# EAGLE design mother4 (EAGLE 8.3.1)
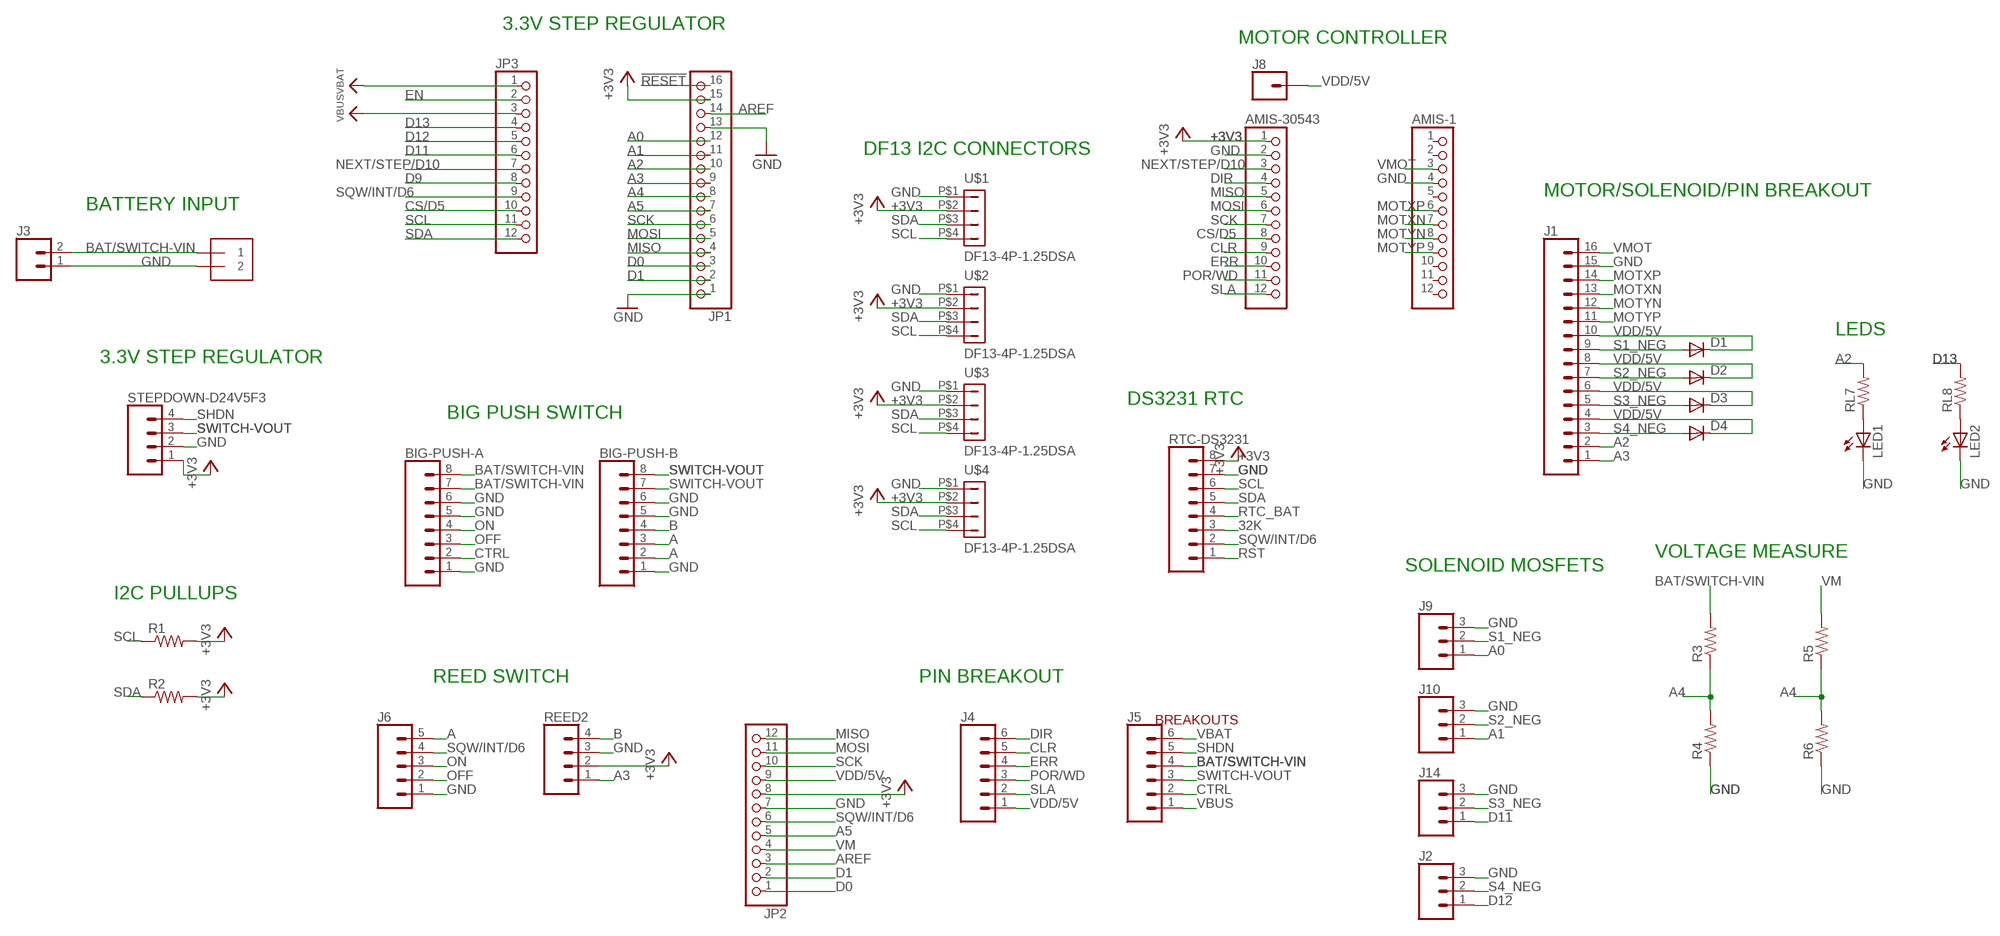
[diagram p0: schematic, sheet 1]

## Parts
AMIS-1  PINHD-1X12-CB  [1X12-CB]
AMIS-30543  PINHD-1X12-CB  [1X12-CB]
BAT  1X2-3.5MM  [1X2-3.5MM]
BIG-PUSH-A  CONN_08"  [1X08]
BIG-PUSH-B  CONN_08"  [1X08]
D1  1N4148DO35-7  [DO35-7]
D2  1N4148DO35-7  [DO35-7]
D3  1N4148DO35-7  [DO35-7]
D4  1N4148DO35-7  [DO35-7]
J1  CONN_16  [1X16]
J2  CONN_03  [1X03]
J3  CONN_02  [1X02]
J4  CONN_06SILK_FEMALE_PTH  [1X06]
J5  CONN_06SILK_FEMALE_PTH  [1X06]
J6  CONN_05  [1X05]
J8  CONN_01  [1X01]
J9  CONN_03  [1X03]
J10  CONN_03  [1X03]
J14  CONN_03  [1X03]
JP1  HEADER-1X16ROUND  [1X16_ROUND]
JP2  HEADER-1X12  [1X12_ROUND]
JP3  HEADER-1X12  [1X12_ROUND]
LED1  LED5MM  [LED5MM]
LED2  LED5MM  [LED5MM]
R1  R-US_0207/10  [0207/10]
R2  R-US_0207/10  [0207/10]
R3  R-US_0207/10  [0207/10]
R4  R-US_0207/10  [0207/10]
R5  R-US_0207/10  [0207/10]
R6  R-US_0207/10  [0207/10]
REED2  CONN_04  [1X04]
RL7  R-US_0207/10  [0207/10]
RL8  R-US_0207/10  [0207/10]
RTC-DS3231  CONN_08"  [1X08]
STEPDOWN-D24V5F3  CONN_04  [1X04]
U$1  DF13-4P-1.25DSA  [DF13-4P-1.25DSA]
U$2  DF13-4P-1.25DSA  [DF13-4P-1.25DSA]
U$3  DF13-4P-1.25DSA  [DF13-4P-1.25DSA]
U$4  DF13-4P-1.25DSA  [DF13-4P-1.25DSA]

## Nets
32K: RTC-DS3231.3
!RESET: JP1.16
+3V3: AMIS-30543.1 JP1.15 JP2.8 R1.2 R2.2 REED2.2 RTC-DS3231.8 STEPDOWN-D24V5F3.1 U$1.P$2 U$2.P$2 U$3.P$2 U$4.P$2
A: BIG-PUSH-B.2 BIG-PUSH-B.3 J6.5
A0: J9.1 JP1.12
A1: J10.1 JP1.11
A2: J1.2 JP1.10 RL7.2
A3: J1.1 JP1.9 REED2.1
A4: JP1.8 R3.1 R4.2 R5.1 R6.2
A5: JP1.7 JP2.5
AREF: JP1.14 JP2.3
B: BIG-PUSH-B.4 REED2.4
BAT/SWITCH-VIN: BAT.1 BIG-PUSH-A.7 BIG-PUSH-A.8 J3.2 J5.4 R3.2
CLR: AMIS-30543.9 J4.5
CS/D5: AMIS-30543.8 JP3.10
CTRL: BIG-PUSH-A.2 J5.2
D0: JP1.3 JP2.1
D1: JP1.2 JP2.2
D9: JP3.8
D11: J14.1 JP3.6
D12: J2.1 JP3.5
D13: JP3.4 RL8.2
DIR: AMIS-30543.4 J4.6
EN: JP3.2
ERR: AMIS-30543.10 J4.4
GND: AMIS-1.4 AMIS-30543.2 BAT.2 BIG-PUSH-A.1 BIG-PUSH-A.5 BIG-PUSH-A.6 BIG-PUSH-B.1 BIG-PUSH-B.5 BIG-PUSH-B.6 J1.15 J2.3 J3.1 J6.1 J9.3 J10.3 J14.3 JP1.1 JP1.13 JP2.7 LED1.K(C) LED2.K(C) R4.1 R6.1 REED2.3 RTC-DS3231.7 STEPDOWN-D24V5F3.2 U$1.P$1 U$2.P$1 U$3.P$1 U$4.P$1
MISO: AMIS-30543.5 JP1.4 JP2.12
MOSI: AMIS-30543.6 JP1.5 JP2.11
MOTXN: AMIS-1.7 J1.13
MOTXP: AMIS-1.6 J1.14
MOTYN: AMIS-1.8 J1.12
MOTYP: AMIS-1.9 J1.11
N$1: LED1.A RL7.1
N$2: LED2.A RL8.1
NEXT/STEP/D10: AMIS-30543.3 JP3.7
OFF: BIG-PUSH-A.3 J6.2
ON: BIG-PUSH-A.4 J6.3
POR/WD: AMIS-30543.11 J4.3
RST: RTC-DS3231.1
RTC_BAT: RTC-DS3231.4
S1_NEG: D1.A J1.9 J9.2
S2_NEG: D2.A J1.7 J10.2
S3_NEG: D3.A J1.5 J14.2
S4_NEG: D4.A J1.3 J2.2
SCK: AMIS-30543.7 JP1.6 JP2.10
SCL: JP3.11 R1.1 RTC-DS3231.6 U$1.P$4 U$2.P$4 U$3.P$4 U$4.P$4
SDA: JP3.12 R2.1 RTC-DS3231.5 U$1.P$3 U$2.P$3 U$3.P$3 U$4.P$3
SHDN: J5.5 STEPDOWN-D24V5F3.4
SLA: AMIS-30543.12 J4.2
SQW/INT/D6: J6.4 JP2.6 JP3.9 RTC-DS3231.2
SWITCH-VOUT: BIG-PUSH-B.7 BIG-PUSH-B.8 J5.3 STEPDOWN-D24V5F3.3
VBAT: J5.6 JP3.1
VBUS: J5.1 JP3.3
VDD/5V: D1.C D2.C D3.C D4.C J1.4 J1.6 J1.8 J1.10 J4.1 J8.1 JP2.9
VM: JP2.4 R5.2
VMOT: AMIS-1.3 J1.16
Unconnected: AMIS-1.1 AMIS-1.2 AMIS-1.5 AMIS-1.10 AMIS-1.11 AMIS-1.12

## Notes on the sheet
- 3.3V STEP REGULATOR
- MOTOR CONTROLLER
- DF13 I2C CONNECTORS
- MOTOR/SOLENOID/PIN BREAKOUT
- BATTERY INPUT
- LEDS
- 3.3V STEP REGULATOR
- DS3231 RTC
- BIG PUSH SWITCH
- VOLTAGE MEASURE
- SOLENOID MOSFETS
- I2C PULLUPS
- REED SWITCH | PIN BREAKOUT
- BREAKOUTS

## Library data of the parts
AMIS-1 AMIS-30543 = adafruit:PINHD-1X12: PIN HEADER
BAT = adafruit:1X2: 3.5mm Terminal block http://www.ladyada.net/library/pcb/eaglelibrary.html
BIG-PUSH-A BIG-PUSH-B RTC-DS3231 = SparkFun-Connectors:CONN_08: Multi connection point. Often used as Generic Header-pin footprint for 0.1 inch spaced/style header connections On any of the 0.1 inch spaced packages, you can populate with these: Break Away Headers - Straight <https://www.sparkfun.com/products/116> (PRT-00116) Break Away Male Headers - Right Angle <https://www.sparkfun.com/products/553> (PRT-00553) Female Headers <https://www.sparkfun.com/products/115> (PRT-00115) Break Away Headers - Machine Pin <https://www.sparkfun.com/products/117> (PRT-00117) Break Away Female Headers - Swiss Machine Pin <https://www.sparkfun.com/products/743> (PRT-00743) Arduino Stackable Header - 8 Pin <https://www.sparkfun.com/products/9279> (PRT-09279) For SCREWTERMINALS and SPRING TERMINALS visit here: Screw Terimnals on SparkFun.com <https://www.sparkfun.com/search/results?term=Screw+Terminals> (5mm/3.5mm/2.54mm spacing) This device is also useful as a general connection point to wire up your design to another part of your project. Our various solder wires solder well into these plated through hole pads. Hook-Up Wire - Assortment (Stranded, 22 AWG) <https://www.sparkfun.com/products/11375> (PRT-11375) Hook-Up Wire - Assortment (Solid Core, 22 AWG) <https://www.sparkfun.com/products/11367> (PRT-11367) View the entire wire category on our website here <https://www.sparkfun.com/categories/141> Special notes: Molex polarized connector foot print use with SKU : PRT-08231 with associated crimp pins and housings. 1MM SMD Version SKU: PRT-10208 NOTES ON THE VARIANTS LOCK and LOCK_LONGPADS... This footprint was designed to help hold the alignment of a through-hole component (i.e. 6-pin header) while soldering it into place. You may notice that each hole has been shifted either up or down by 0.005 of an inch from it's more standard position (which is a perfectly straight line). This slight alteration caused the pins (the squares in the middle) to touch the edges of the holes. Because they are alternating, it causes a "brace" to hold the component in place. 0.005 has proven to be the perfect amount of "off-center" position when using our standard breakaway headers. Although looks a little odd when you look at the bare footprint, once you have a header in there, the alteration is very hard to notice. Also,if you push a header all the way into place, it is covered up entirely on the bottom side.; PROD_ID: CONN-08438
D1-D4 = diode:1N4148: DIODE high speed (Philips)
J1 = SparkFun-Connectors:CONN_16: Multi connection point. Often used as Generic Header-pin footprint for 0.1 inch spaced/style header connections On any of the 0.1 inch spaced packages, you can populate with these: Break Away Headers - Straight <https://www.sparkfun.com/products/116> (PRT-00116) Break Away Male Headers - Right Angle <https://www.sparkfun.com/products/553> (PRT-00553) Female Headers <https://www.sparkfun.com/products/115> (PRT-00115) Break Away Headers - Machine Pin <https://www.sparkfun.com/products/117> (PRT-00117) Break Away Female Headers - Swiss Machine Pin <https://www.sparkfun.com/products/743> (PRT-00743) For SCREWTERMINALS and SPRING TERMINALS visit here: Screw Terimnals on SparkFun.com <https://www.sparkfun.com/search/results?term=Screw+Terminals> (5mm/3.5mm/2.54mm spacing) This device is also useful as a general connection point to wire up your design to another part of your project. Our various solder wires solder well into these plated through hole pads. Hook-Up Wire - Assortment (Stranded, 22 AWG) <https://www.sparkfun.com/products/11375> (PRT-11375) Hook-Up Wire - Assortment (Solid Core, 22 AWG) <https://www.sparkfun.com/products/11367> (PRT-11367) View the entire wire category on our website here <https://www.sparkfun.com/categories/141> Special notes: Molex polarized connector foot print use with SKU : PRT-08231 with associated crimp pins and housings. 1MM SMD Version SKU: PRT-10208 NOTES ON THE VARIANTS LOCK and LOCK_LONGPADS... This footprint was designed to help hold the alignment of a through-hole component (i.e. 6-pin header) while soldering it into place. You may notice that each hole has been shifted either up or down by 0.005 of an inch from it's more standard position (which is a perfectly straight line). This slight alteration caused the pins (the squares in the middle) to touch the edges of the holes. Because they are alternating, it causes a "brace" to hold the component in place. 0.005 has proven to be the perfect amount of "off-center" position when using our standard breakaway headers. Although looks a little odd when you look at the bare footprint, once you have a header in there, the alteration is very hard to notice. Also,if you push a header all the way into place, it is covered up entirely on the bottom side.
J2 J9 J10 J14 = SparkFun-Connectors:CONN_03: Multi connection point. Often used as Generic Header-pin footprint for 0.1 inch spaced/style header connections On any of the 0.1 inch spaced packages, you can populate with these: Break Away Headers - Straight <https://www.sparkfun.com/products/116> (PRT-00116) Break Away Male Headers - Right Angle <https://www.sparkfun.com/products/553> (PRT-00553) Female Headers <https://www.sparkfun.com/products/115> (PRT-00115) Break Away Headers - Machine Pin <https://www.sparkfun.com/products/117> (PRT-00117) Break Away Female Headers - Swiss Machine Pin <https://www.sparkfun.com/products/743> (PRT-00743) Stackable Header - 3 Pin (Female, 0.1") <https://www.sparkfun.com/products/13875> (PRT-13875) For SCREWTERMINALS and SPRING TERMINALS visit here: Screw Terimnals on SparkFun.com <https://www.sparkfun.com/search/results?term=Screw+Terminals> (5mm/3.5mm/2.54mm spacing) This device is also useful as a general connection point to wire up your design to another part of your project. Our various solder wires solder well into these plated through hole pads. Hook-Up Wire - Assortment (Stranded, 22 AWG) <https://www.sparkfun.com/products/11375> (PRT-11375) Hook-Up Wire - Assortment (Solid Core, 22 AWG) <https://www.sparkfun.com/products/11367> (PRT-11367) View the entire wire category on our website here <https://www.sparkfun.com/categories/141> Special notes: Molex polarized connector foot print use with SKU : PRT-08232 with associated crimp pins and housings.
J3 = SparkFun-Connectors:CONN_02: Multi connection point. Often used as Generic Header-pin footprint for 0.1 inch spaced/style header connections On any of the 0.1 inch spaced packages, you can populate with these: Break Away Headers - Straight <https://www.sparkfun.com/products/116> (PRT-00116) Break Away Male Headers - Right Angle <https://www.sparkfun.com/products/553> (PRT-00553) Female Headers <https://www.sparkfun.com/products/115> (PRT-00115) Break Away Headers - Machine Pin <https://www.sparkfun.com/products/117> (PRT-00117) Break Away Female Headers - Swiss Machine Pin <https://www.sparkfun.com/products/743> (PRT-00743) For SCREWTERMINALS and SPRING TERMINALS visit here: Screw Terimnals on SparkFun.com <https://www.sparkfun.com/search/results?term=Screw+Terminals> (5mm/3.5mm/2.54mm spacing) This device is also useful as a general connection point to wire up your design to another part of your project. Our various solder wires solder well into these plated through hole pads. Hook-Up Wire - Assortment (Stranded, 22 AWG) <https://www.sparkfun.com/products/11375> (PRT-11375) Hook-Up Wire - Assortment (Solid Core, 22 AWG) <https://www.sparkfun.com/products/11367> (PRT-11367) View the entire wire category on our website here <https://www.sparkfun.com/categories/141> Special notes: Molex polarized connector foot print use with: PRT-08233 with associated crimp pins and housings. 2.54_SCREWTERM for use with PRT-10571. 3.5mm Screw Terminal footprints for PRT-08084 5mm Screw Terminal footprints for use with PRT-08432
J4 J5 = SparkFun-Connectors:CONN_06: Multi connection point. Often used as Generic Header-pin footprint for 0.1 inch spaced/style header connections On any of the 0.1 inch spaced packages, you can populate with these: Break Away Headers - Straight <https://www.sparkfun.com/products/116> (PRT-00116) Break Away Male Headers - Right Angle <https://www.sparkfun.com/products/553> (PRT-00553) Female Headers <https://www.sparkfun.com/products/115> (PRT-00115) Break Away Headers - Machine Pin <https://www.sparkfun.com/products/117> (PRT-00117) Break Away Female Headers - Swiss Machine Pin <https://www.sparkfun.com/products/743> (PRT-00743) Arduino Stackable Header - 6 Pin <https://www.sparkfun.com/products/9280> (PRT-09280) For SCREWTERMINALS and SPRING TERMINALS visit here: Screw Terimnals on SparkFun.com <https://www.sparkfun.com/search/results?term=Screw+Terminals> (5mm/3.5mm/2.54mm spacing) This device is also useful as a general connection point to wire up your design to another part of your project. Our various solder wires solder well into these plated through hole pads. Hook-Up Wire - Assortment (Stranded, 22 AWG) <https://www.sparkfun.com/products/11375> (PRT-11375) Hook-Up Wire - Assortment (Solid Core, 22 AWG) <https://www.sparkfun.com/products/11367> (PRT-11367) View the entire wire category on our website here <https://www.sparkfun.com/categories/141>; PROD_ID: CONN-08437
J6 = SparkFun-Connectors:CONN_05: Multi connection point. Often used as Generic Header-pin footprint for 0.1 inch spaced/style header connections On any of the 0.1 inch spaced packages, you can populate with these: Break Away Headers - Straight <https://www.sparkfun.com/products/116> (PRT-00116) Break Away Male Headers - Right Angle <https://www.sparkfun.com/products/553> (PRT-00553) Female Headers <https://www.sparkfun.com/products/115> (PRT-00115) Break Away Headers - Machine Pin <https://www.sparkfun.com/products/117> (PRT-00117) Break Away Female Headers - Swiss Machine Pin <https://www.sparkfun.com/products/743> (PRT-00743) For SCREWTERMINALS and SPRING TERMINALS visit here: Screw Terimnals on SparkFun.com <https://www.sparkfun.com/search/results?term=Screw+Terminals> (5mm/3.5mm/2.54mm spacing) This device is also useful as a general connection point to wire up your design to another part of your project. Our various solder wires solder well into these plated through hole pads. Hook-Up Wire - Assortment (Stranded, 22 AWG) <https://www.sparkfun.com/products/11375> (PRT-11375) Hook-Up Wire - Assortment (Solid Core, 22 AWG) <https://www.sparkfun.com/products/11367> (PRT-11367) View the entire wire category on our website here <https://www.sparkfun.com/categories/141> Special notes: Molex polarized connector foot print use with SKU : PRT-08231 with associated crimp pins and housings. 1MM SMD Version SKU: PRT-10208
J8 = SparkFun-Connectors:CONN_01: Single connection point. Often used as Generic Header-pin footprint for 0.1 inch spaced/style header connections On any of the 0.1 inch spaced packages, you can populate with these: Break Away Headers - Straight <https://www.sparkfun.com/products/116> (PRT-00116) Break Away Male Headers - Right Angle <https://www.sparkfun.com/products/553> (PRT-00553) Female Headers <https://www.sparkfun.com/products/115> (PRT-00115) Break Away Headers - Machine Pin <https://www.sparkfun.com/products/117> (PRT-00117) Break Away Female Headers - Swiss Machine Pin <https://www.sparkfun.com/products/743> (PRT-00743) This device is also useful as a general connection point to wire up your design to another part of your project. Our various solder wires solder well into these plated through hole pads. Hook-Up Wire - Assortment (Stranded, 22 AWG) <https://www.sparkfun.com/products/11375> (PRT-11375) Hook-Up Wire - Assortment (Solid Core, 22 AWG) <https://www.sparkfun.com/products/11367> (PRT-11367) View the entire wire category on our website here <https://www.sparkfun.com/categories/141> Special notes: SMTSO-256-ET is a "flush mount" nut for a 4-40 screw. We mostly use this on specialty testbeds; it is a nice way to connect hardware to your PCB at an adjustable hieght. Also note, the SNAP packages are for using a snappable style connector. We sell a baggie of snaps and they are also used on two LilyPad designs: Snap Assortment - 30 pack (male and female) <https://www.sparkfun.com/products/11347> (DEV-11347) LilyPad Arduino SimpleSnap <https://www.sparkfun.com/products/10941> (DEV-10941) LilyPad SimpleSnap Protoboard <https://www.sparkfun.com/products/10940> (DEV-10940)
JP1 = microbuilder:HEADER-1X16: PIN HEADER
JP2 JP3 = microbuilder:HEADER-1X12
LED1 LED2 = adafruit:LED: LED OSRAM: - CHIPLED LG R971, LG N971, LY N971, LG Q971, LY Q971, LO R971, LY R971 LH N974, LH R974 LS Q976, LO Q976, LY Q976 LO Q996 - Hyper CHIPLED LW Q18S LB Q993, LB Q99A, LB R99A - SideLED LS A670, LO A670, LY A670, LG A670, LP A670 LB A673, LV A673, LT A673, LW A673 LH A674 LY A675 LS A676, LA A676, LO A676, LY A676, LW A676 LS A679, LY A679, LG A679 - Hyper Micro SIDELED® LS Y876, LA Y876, LO Y876, LY Y876 LT Y87S - SmartLED LW L88C, LW L88S LB L89C, LB L89S, LG L890 LS L89K, LO L89K, LY L89K LS L896, LA L896, LO L896, LY L896 - TOPLED LS T670, LO T670, LY T670, LG T670, LP T670 LSG T670, LSP T670, LSY T670, LOP T670, LYG T670 LG T671, LOG T671, LSG T671 LB T673, LV T673, LT T673, LW T673 LH T674 LS T676, LA T676, LO T676, LY T676, LB T676, LH T676, LSB T676, LW T676 LB T67C, LV T67C, LT T67C, LS T67K, LO T67K, LY T67K, LW E67C LS E67B, LA E67B, LO E67B, LY E67B, LB E67C, LV E67C, LT E67C LW T67C LS T679, LY T679, LG T679 LS T770, LO T770, LY T770, LG T770, LP T770 LB T773, LV T773, LT T773, LW T773 LH T774 LS E675, LA E675, LY E675, LS T675 LS T776, LA T776, LO T776, LY T776, LB T776 LHGB T686 LT T68C, LB T68C - Hyper Mini TOPLED® LB M676 - Mini TOPLED Santana® LG M470 LS M47K, LO M47K, LY M47K Source: http://www.osram.convergy.de/
R1-R6 RL7 RL8 = adafruit:R-US_: RESISTOR, American symbol
REED2 STEPDOWN-D24V5F3 = SparkFun-Connectors:CONN_04: Multi connection point. Often used as Generic Header-pin footprint for 0.1 inch spaced/style header connections On any of the 0.1 inch spaced packages, you can populate with these: Break Away Headers - Straight <https://www.sparkfun.com/products/116> (PRT-00116) Break Away Male Headers - Right Angle <https://www.sparkfun.com/products/553> (PRT-00553) Female Headers <https://www.sparkfun.com/products/115> (PRT-00115) Break Away Headers - Machine Pin <https://www.sparkfun.com/products/117> (PRT-00117) Break Away Female Headers - Swiss Machine Pin <https://www.sparkfun.com/products/743> (PRT-00743) For SCREWTERMINALS and SPRING TERMINALS visit here: Screw Terimnals on SparkFun.com <https://www.sparkfun.com/search/results?term=Screw+Terminals> (5mm/3.5mm/2.54mm spacing) This device is also useful as a general connection point to wire up your design to another part of your project. Our various solder wires solder well into these plated through hole pads. Hook-Up Wire - Assortment (Stranded, 22 AWG) <https://www.sparkfun.com/products/11375> (PRT-11375) Hook-Up Wire - Assortment (Solid Core, 22 AWG) <https://www.sparkfun.com/products/11367> (PRT-11367) View the entire wire category on our website here <https://www.sparkfun.com/categories/141> Special notes: Molex polarized connector foot print use with SKU : PRT-08231 with associated crimp pins and housings. 1MM SMD Version SKU: PRT-10208; PROD_ID: CONN-09696
U$1-U$4 = con-hirose-df13:DF13-4P-1.25: DF13-4P 1.25mm Pitch Miniature Crimping Connector.

## Board
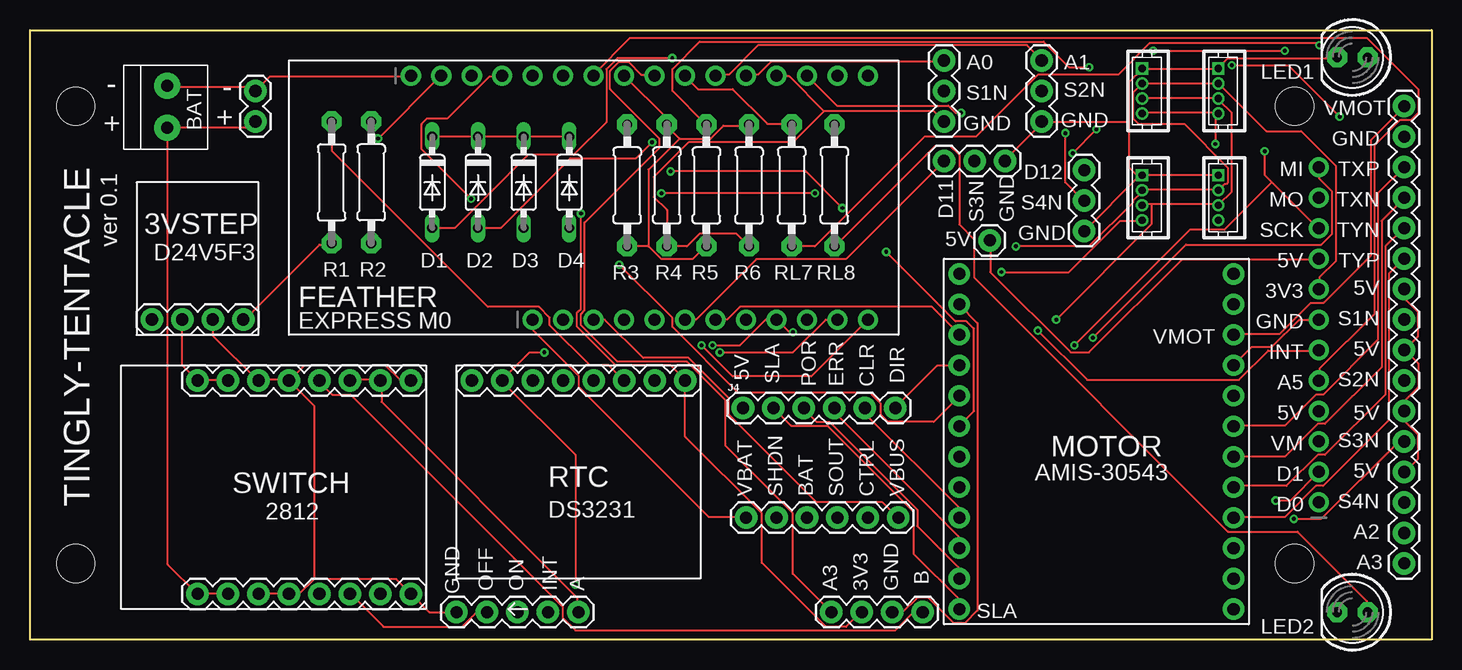
[diagram p1: board, top side]
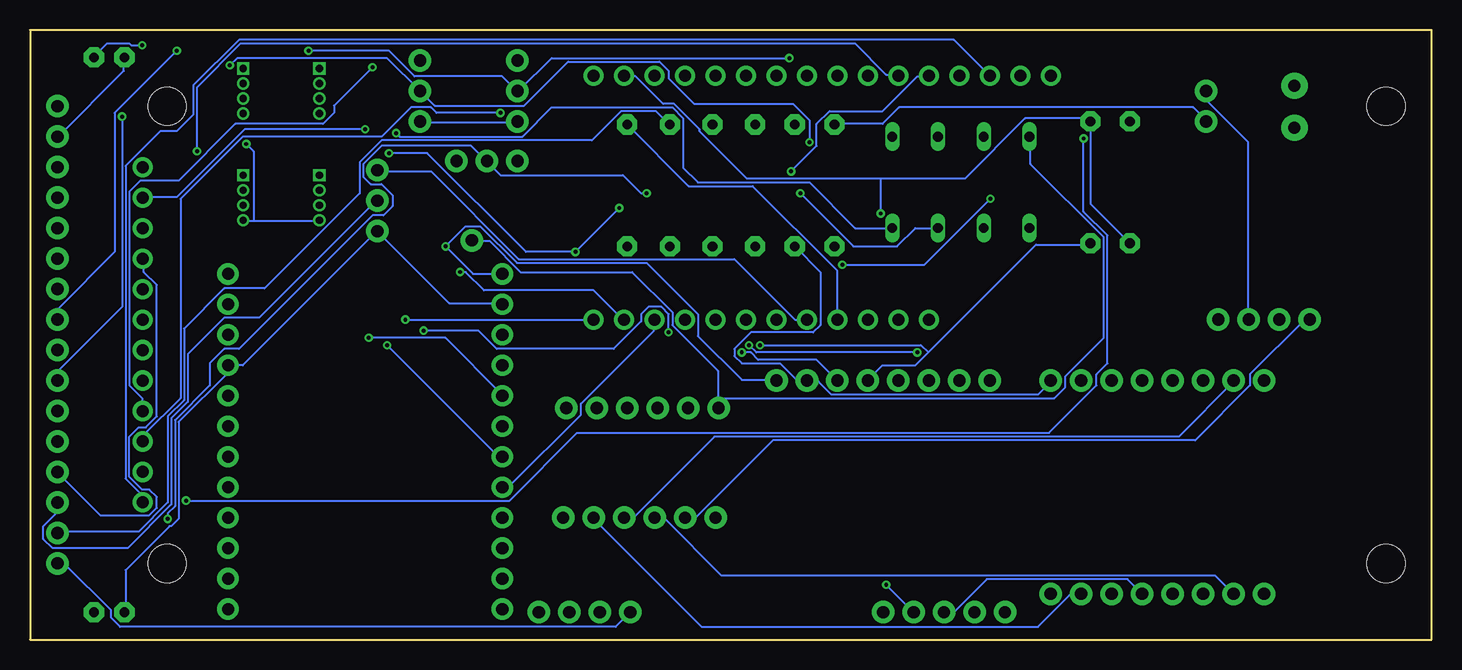
[diagram p2: board, bottom side, seen from below]

Size 116.84 x 50.8 mm. Coordinates in mm from the lower left corner, seen from the top.
Outline: 0,0 0,50.8 116.84,50.8 116.84,0 0,0
Copper layers (1*16): Top 0.0356mm / dielectric 1.5011mm / Bottom 0.0356mm
Design rules "LaenPCBOrder": minimum track width 6mil, minimum drill 13mil, track to track 6mil, track to pad 6mil, pad to pad 6mil, via to via 6mil, smd to smd 6mil, copper to edge 15mil, drill to drill 6mil, minimum pad ring 7mil, minimum via ring 7mil, stop-mask expansion 3mil, vias tented up to drill 0mil, thermal gap 10mil
Holes 3.17 mm at 3.81,44.45 3.81,6.35 105.41,44.45 105.41,6.35

### Footprints (pad centres in the part's own frame; a part is rotated, then mirrored left to right if it is on the bottom)
1X12-CB = drill 1.016 pad 1.778: 1 -13.97,0; 2 -11.43,0; 3 -8.89,0; 4 -6.35,0; 5 -3.81,0; 6 -1.27,0; 7 1.27,0; 8 3.81,0; 9 6.35,0; 10 8.89,0; 11 11.43,0; 12 13.97,0
1X2-3.5MM = drill 1 pad 2.184: 1 1.8,0; 2 -1.7,0
1X08 = drill 1.016 pad 1.88: 1 0,0; 2 2.54,0; 3 5.08,0; 4 7.62,0; 5 10.16,0; 6 12.7,0; 7 15.24,0; 8 17.78,0
DO35-7 = drill 0.813 long: A 3.81,0; C -3.81,0
1X16 = drill 1.016 pad 1.88: 1 0,0; 2 2.54,0; 3 5.08,0; 4 7.62,0; 5 10.16,0; 6 12.7,0; 7 15.24,0; 8 17.78,0; 9 20.32,0; 10 22.86,0; 11 25.4,0; 12 27.94,0; 13 30.48,0; 14 33.02,0; 15 35.56,0; 16 38.1,0
1X03 = drill 1.016 pad 1.88: 1 0,0; 2 2.54,0; 3 5.08,0
1X02 = drill 1.016 pad 1.88: 1 0,0; 2 2.54,0
1X06 = drill 1.016 pad 1.88: 1 0,0; 2 2.54,0; 3 5.08,0; 4 7.62,0; 5 10.16,0; 6 12.7,0
1X05 = drill 1.016 pad 1.88: 1 0,0; 2 2.54,0; 3 5.08,0; 4 7.62,0; 5 10.16,0
1X01 = drill 1.016 pad 1.88: 1 0,0
1X16_ROUND = drill 1 pad 1.676: 1 -19.05,0; 2 -16.51,0; 3 -13.97,0; 4 -11.43,0; 5 -8.89,0; 6 -6.35,0; 7 -3.81,0; 8 -1.27,0; 9 1.27,0; 10 3.81,0; 11 6.35,0; 12 8.89,0; 13 11.43,0; 14 13.97,0; 15 16.51,0; 16 19.05,0
1X12_ROUND = drill 1 pad 1.676: 1 -13.97,0; 2 -11.43,0; 3 -8.89,0; 4 -6.35,0; 5 -3.81,0; 6 -1.27,0; 7 1.27,0; 8 3.81,0; 9 6.35,0; 10 8.89,0; 11 11.43,0; 12 13.97,0
LED5MM = drill 0.813 pad 1.676 octagon: A -1.27,0; K 1.27,0
0207/10 = drill 0.813 pad 1.676 octagon: 1 -5.08,0; 2 5.08,0
1X04 = drill 1.016 pad 1.88: 1 0,0; 2 2.54,0; 3 5.08,0; 4 7.62,0
DF13-4P-1.25DSA = drill 0.6 pad 1.016 square: P$1 1.875,0 | drill 0.6 pad 1.016: P$2 0.625,0; P$3 -0.625,0; P$4 -1.875,0

### Placement (x,y rotation side)
AMIS-1  100.33,16.51 270 top
AMIS-30543  77.47,16.51 270 top
BAT  11.43,44.45 270 top
BIG-PUSH-A  31.75,3.81 180 top
BIG-PUSH-B  31.75,21.59 180 top
D1  33.53,38.1 270 top
D2  37.34,38.1 270 top
D3  41.15,38.1 270 top
D4  44.96,38.1 270 top
J1  114.55,6.35 90 top
J2  87.88,39.12 270 top
J3  18.8,45.72 270 top
J4  59.44,19.3 0 top
J5  72.39,10.16 180 top
J6  35.56,2.29 0 top
J8  80.01,33.27 0 top
J9  76.2,48.26 270 top
J10  84.33,48.26 270 top
J14  76.2,39.88 0 top
JP1  50.8,46.99 0 top
JP2  107.44,25.4 90 top
JP3  55.88,26.67 0 top
LED1  110.24,48.51 180 top
LED2  110.24,2.29 180 top
R1  25.15,38.1 270 top
R2  28.45,38.1 90 top
R3  49.78,37.85 90 top
R4  53.09,37.85 90 top
R5  56.39,37.85 90 top
R6  59.94,37.85 90 top
REED2  66.8,2.29 0 top
RL7  63.5,37.85 90 top
RL8  67.06,37.85 90 top
RTC-DS3231  36.83,21.59 0 top
STEPDOWN-D24V5F3  17.78,26.67 180 top
U$1  92.71,36.83 90 top
U$2  92.71,45.72 90 top
U$3  99.06,36.83 90 top
U$4  99.06,45.72 90 top

### Tracks (layer width: path | path; a pad name or v marks a point on that pad's centre or on a via)
+3V3  (via drill 0.33)
  Top 0.152: R1.2 25.04,32.92 24.13,32.92 17.88,26.67 STEPDOWN-D24V5F3.1 | REED2.2 69.24,2.29 68.02,1.07 66.34,1.07 61.01,6.4 61.01,10.52 54.61,16.92 RTC-DS3231.8 54.61,21.64 53.39,22.86 48.82,22.86 45.62,26.06 45.62,27.28 45.92,27.58 v45.92,35.51 | v82.19,32.77 88.29,32.77 91.95,36.42 91.95,36.58 92.71,37.34 U$1.P$2 92.71,37.49 98.96,37.49 U$3.P$2 99.11,37.49 99.57,37.95 99.72,37.95 99.87,38.1 99.87,39.32 96.21,42.98 92.41,42.98 91.95,43.43 91.95,45.57 U$2.P$2 | U$2.P$2 98.96,46.33 U$4.P$2 99.11,46.33 103.07,42.37 105.97,42.37 108.86,39.47 108.86,31.55 107.49,30.18 107.49,29.26 JP2.8 | U$2.P$2
  Bottom 0.152: R1.2 28.4,36.27 28.4,43.13 R2.2 28.7,43.43 33.88,43.43 38.91,38.41 45.92,38.41 | 45.92,38.41 57.05,38.41 61.01,42.37 61.01,42.52 63.14,44.65 64.06,44.65 66.34,46.94 67.26,46.94 JP1.15 | AMIS-30543.1 79.91,30.48 v82.19,32.77 80.52,34.44 79.3,34.44 76.25,31.39 65.43,31.39 61.16,27.13 61.16,25.3 57.51,21.64 54.61,21.64 RTC-DS3231.8 | v45.92,35.51 45.92,38.41
A
  Top 0.152: BIG-PUSH-B.3 26.72,21.64 29.16,21.64 BIG-PUSH-B.2 29.31,21.49 29.31,19.81 45.62,3.5 45.62,2.29 J6.5
A0
  Top 0.152: JP1.12 59.79,47.09 60.71,47.09 61.77,48.16 76.1,48.16 J9.1
A1
  Top 0.152: JP1.11 57.2,47.09 58.27,47.09 60.71,49.53 83.11,49.53 84.33,48.31 J10.1
A2
  Top 0.152: RL7.2 63.45,42.98 61.47,42.98 58.57,45.87 55.68,45.87 54.61,46.94 JP1.10
  Bottom 0.152: J1.2 114.5,8.99 107.8,8.99 105.36,11.43 105.36,18.59 103.99,19.96 103.99,25.91 100.63,29.26 97.28,29.26 89.36,37.19 89.36,39.78 87.53,41.6 70,41.6 67.56,44.04 64.67,44.04 63.6,42.98 RL7.2
A3
  Top 0.152: REED2.1 63.6,5.49 63.6,10.52 57.96,16.15 57.96,19.96 54.76,23.16 48.97,23.16 45.92,26.21 45.92,27.13 46.23,27.43 46.23,34.75 52.48,41 52.48,41.76 48.36,45.87 48.36,47.4 49.12,48.16 49.89,48.16 50.95,47.09 52.02,47.09 JP1.9
  Bottom 0.152: REED2.1 68.02,1.07 109.32,1.07 110.08,1.83 110.08,2.44 113.89,6.25 114.5,6.25 J1.1
A4
  Top 0.152: 51.56,32.77 R3.1 | 51.56,32.77 52.63,31.7 55.22,31.7 56.29,32.77 R5.1 | JP1.8 53.09,43.43 R4.2 53.09,42.82 54.15,41.76 | 54.15,41.76 56.74,41.76 57.81,42.82 59.94,42.82 R6.2 | 51.56,32.77 51.56,39.17 54.15,41.76
A5
  Top 0.152: JP2.5 107.49,21.64 107.49,22.55 112.06,27.13 112.06,41.15 114.2,43.28 115.11,43.28 115.72,43.89 115.72,45.87 111.45,50.14 50.04,50.14 46.99,47.09 JP1.7
AREF  (via drill 0.33)
  Top 0.152: v77.62,43.89 77.16,43.89 76.56,44.5 67.26,44.5 JP1.14
  Bottom 0.152: v77.62,43.89 82.96,43.89 83.41,44.35 85.09,44.35 87.53,41.91 99.11,41.91 104.29,36.73 104.29,20.12 107.34,17.07 107.34,16.61 JP2.3
B
  Top 0.152: REED2.4 73.66,2.29 72.14,0.76 45.47,0.76 44.4,1.83 44.4,2.74 26.72,20.42 25.2,20.42 24.13,21.49 BIG-PUSH-B.4
BAT/SWITCH-VIN
  Top 0.152: J3.2 18.8,43.13 18.34,42.67 11.48,42.67 BAT.1 11.48,42.52 11.48,6.25 13.92,3.81 BIG-PUSH-A.8 BIG-PUSH-A.7
  Bottom 0.152: R3.2 49.73,42.98 45.77,42.98 44.4,44.35 19.86,44.35 18.8,43.28 J3.2 | BIG-PUSH-A.7 18.03,5.33 59.18,5.33 63.91,10.06 64.67,10.06 J5.4
CLR
  Top 0.152: AMIS-30543.9 77.47,10.97 69.7,18.75 69.7,19.2 J4.5
CS/D5
  Bottom 0.152: JP3.10 64.82,26.67 64.82,25.76 70.92,19.66 70.92,18.75 76.86,12.8 77.47,12.8 AMIS-30543.8
CTRL
  Bottom 0.152: BIG-PUSH-A.2 30.07,3.81 32.82,1.07 60.86,1.07 69.85,10.06 J5.2
D0
  Bottom 0.152: JP1.3 39.83,49.99 99.42,49.99 103.23,46.18 103.23,43.74 104.6,42.37 105.97,42.37 108.86,39.47 108.86,13.41 107.49,12.04 107.49,11.43 JP2.1
D1  (via drill 0.33)
  Top 0.152: v29.01,41.76 34.19,46.94 JP1.2 | v103.83,11.58 105.05,11.58 JP2.2
  Bottom 0.152: v29.01,41.76 29.01,35.66 27.03,33.68 27.03,23.01 27.94,22.1 27.94,21.18 31.9,17.22 71.22,17.22 76.86,11.58 v103.83,11.58
D11
  Top 0.152: JP3.6 55.52,26.67 60.55,31.7 68.02,31.7 J14.1
D12
  Bottom 0.152: JP3.5 53.09,26.67 58.12,31.7 76.1,31.7 83.41,39.01 87.83,39.01 J2.1
D13
  Bottom 0.152: RL8.2 61.93,37.8 56.59,37.8 49.58,30.79 49.58,26.67 JP3.4
DIR
  Top 0.152: AMIS-30543.4 75.64,22.86 72.14,19.36 J4.6
ERR
  Top 0.152: AMIS-30543.10 77.47,8.53 67.11,18.9 67.11,19.2 J4.4
GND
  Top 0.152: JP1.1 31.75,46.94 20.02,46.94 J3.1 18.49,46.02 11.48,46.02 BAT.2 | BIG-PUSH-A.6 BIG-PUSH-A.5 22.45,3.81 23.67,5.03 | J6.1 33.27,2.29 BIG-PUSH-A.1 30.53,5.03 23.67,5.03 | BIG-PUSH-B.5 21.54,21.64 19.1,21.64 BIG-PUSH-B.6 18.95,21.64 15.29,25.3 15.29,26.67 STEPDOWN-D24V5F3.2 | BIG-PUSH-B.1 31.75,21.64 30.84,21.64 29.62,22.86 22.91,22.86 21.69,21.64 BIG-PUSH-B.5 | 23.67,5.03 23.67,19.51 BIG-PUSH-B.5 | R6.1 58.88,33.83 55.83,33.83 54.76,32.77 R4.1 53.09,35.81 52.02,36.88 52.02,38.56 54.92,41.45 63.6,41.45 66.19,44.04 | 66.19,44.04 63.3,46.94 62.23,46.94 JP1.13 | 66.19,44.04 75.34,44.04 J9.3 | JP2.7 105.82,26.67 103.53,24.38 101.85,24.38 AMIS-1.4 | 84.33,43.13 84.33,42.98 81.28,39.93 J14.3 | 92.71,47.55 98.96,47.55 U$4.P$1 99.11,47.7 99.87,48.46 108.86,48.46 LED1.K | U$1.P$1 98.96,38.71 U$3.P$1 | REED2.3 72.75,2.29 73.96,3.5 74.88,3.5 77.01,1.37 77.93,1.37 78.99,2.44 78.99,26.36 77.47,27.89 AMIS-30543.2 | 92.41,38.56 92.71,38.56 U$1.P$1 | J2.3 92.41,38.56 | 92.71,47.55 91.64,46.48 91.64,43.13 | 91.64,43.13 91.64,39.32 92.41,38.56 | 92.71,47.55 U$2.P$1 | 92.41,38.56 U$1.P$1 | 91.64,43.13 84.33,43.13 | 84.33,43.13 J10.3
  Bottom 0.152: BIG-PUSH-B.1 31.75,21.49 32.82,20.42 50.04,20.42 51.11,21.49 52.02,21.49 RTC-DS3231.7 52.17,21.64 52.93,21.64 54.3,23.01 57.51,23.01 58.12,23.62 58.12,24.23 56.74,25.6 51.56,25.6 50.95,26.21 50.95,30.63 R4.1 | J3.1 18.8,44.96 15.29,41.45 15.29,26.67 STEPDOWN-D24V5F3.2 | LED2.K 108.86,2.29 108.86,5.79 105.21,9.45 105.05,9.45 104.44,10.06 104.44,18.14 100.33,22.25 AMIS-1.4 99.11,22.86 87.99,33.98 J2.3 81.89,28.04 77.47,28.04 AMIS-30543.2 | LED1.K 109.02,48.46 109.02,47.4 114.5,41.91 J1.15 | J9.3 76.25,43.13 84.33,43.13 J10.3
MISO  (via drill 0.33)
  Top 0.152: v36.78,36.73 32.66,40.84 32.66,42.98 33.12,43.43 34.8,43.43 38.3,46.94 39.37,46.94 JP1.4 | v49.12,31.24 53.54,26.82 53.54,26.06 59.03,20.57 70,20.57 70.92,19.66 70.92,18.75 71.53,18.14 75.34,18.14 77.47,20.27 AMIS-30543.5 | v88.59,25.15 96.37,32.92 107.64,32.92 108.56,33.83 108.56,37.34 107.49,38.41 107.49,39.32 JP2.12
  Bottom 0.152: v36.78,36.73 42.27,31.24 v49.12,31.24 | v88.59,25.15 82.19,25.15 77.47,20.42 AMIS-30543.5
MOSI  (via drill 0.33)
  Top 0.152: v53.39,39.01 64.67,39.01 v67.72,35.97 | v71.37,32.31 77.16,26.52 78.08,26.52 78.69,25.91 78.69,19.05 77.47,17.83 AMIS-30543.6 | v86.92,40.54 v88.9,42.52
  Bottom 0.152: v53.39,39.01 51.26,41.15 51.26,42.98 50.19,44.04 45.77,44.04 42.88,46.94 41.96,46.94 JP1.5 | v67.72,35.97 v71.37,32.31 75.49,32.31 83.72,40.54 v86.92,40.54 | v88.9,42.52 98.96,42.52 104.6,36.88 107.34,36.88 JP2.11
MOTXN
  Top 0.152: AMIS-1.7 104.6,15.24 107.34,17.98 107.95,17.98 112.67,22.71 112.67,34.9 114.5,36.73 J1.13
MOTXP
  Top 0.152: J1.14 112.37,37.19 112.37,24.99 107.8,20.42 107.19,20.42 104.6,17.83 100.33,17.83 AMIS-1.6
MOTYN
  Top 0.152: AMIS-1.8 100.33,12.8 104.75,12.8 107.34,15.39 107.95,15.39 112.98,20.42 112.98,32.77 114.5,34.29 J1.12
MOTYP
  Top 0.152: J1.11 113.28,30.48 113.28,18.29 107.8,12.8 107.19,12.8 104.6,10.21 100.33,10.21 AMIS-1.9
N$1  (via drill 0.33)
  Top 0.152: RL7.1 65.43,32.77 74.57,41.91 78.84,41.91 84.02,47.09 90.73,47.09 93.32,49.68 107.34,49.68 v107.49,49.53
  Bottom 0.152: v107.49,49.53 108.41,49.53 108.56,49.68 110.39,49.68 111.45,48.62 LED1.A
N$2
  Top 0.152: LED2.A 111.45,2.29 111.45,3.2 105.66,8.99 99.87,8.99 78.69,30.18 78.69,33.38 77.47,34.59 77.47,40.39 76.71,41.15 75.49,41.15 67.11,32.77 RL8.1
NEXT/STEP/D10
  Top 0.152: JP3.7 58.12,26.67 59.18,27.74 75.18,27.74 77.47,25.45 AMIS-30543.3
OFF
  Top 0.152: J6.2 37.24,2.29 36.02,1.07 29.46,1.07 26.72,3.81 BIG-PUSH-A.3
ON
  Bottom 0.152: J6.3 39.83,2.29 37.08,5.03 25.35,5.03 BIG-PUSH-A.4
POR/WD
  Top 0.152: AMIS-30543.11 77.47,5.94 73.96,9.45 73.96,10.82 66.65,18.14 65.58,18.14 64.52,19.2 J4.3
S1_NEG  (via drill 0.33)
  Top 0.152: D1.A 35.41,34.29 41.5,40.39 45.31,40.39 48.06,43.13 48.06,47.55 48.97,48.46 v53.54,48.46 | v93.62,49.07 v104.6,49.07
  Bottom 0.152: v53.54,48.46 73.35,48.46 76.1,45.72 J9.2 76.25,45.72 77.47,46.94 84.78,46.94 86.92,49.07 v93.62,49.07 | v104.6,49.07 109.78,43.89 109.78,32.31 114.5,27.58 114.5,26.67 J1.9
S2_NEG  (via drill 0.33)
  Top 0.152: D2.A 39.22,34.29 45.01,40.08 50.5,40.08 v51.87,41.45 | v109.17,43.59 104.9,47.85 v100.18,47.85
  Bottom 0.152: v51.87,41.45 51.87,43.28 53.24,44.65 61.47,44.65 63.6,46.79 63.6,47.4 64.36,48.16 71.98,48.16 75.64,44.5 83.11,44.5 J10.2 87.07,48.46 99.57,48.46 v100.18,47.85 | v109.17,43.59 109.17,27.74 114.5,22.4 114.5,21.64 J1.7
S3_NEG  (via drill 0.33)
  Top 0.152: v65.43,37.19 v52.63,37.19 | v105.36,10.06 107.64,10.06 114.05,16.46 114.5,16.46 J1.5
  Bottom 0.152: D3.A 43.03,34.29 44.55,32.77 48.21,32.77 v52.63,37.19 | v65.43,37.19 65.89,37.19 67.41,38.71 77.62,38.71 78.69,39.78 J14.2 78.84,39.93 80.06,41.15 87.53,41.15 89.05,39.62 89.05,38.56 88.44,37.95 87.53,37.95 86.61,37.03 86.61,36.12 87.38,35.36 88.29,35.36 99.42,24.23 100.63,24.23 101.85,23.01 101.85,21.18 104.75,18.29 104.75,11.12 105.36,10.52 v105.36,10.06
S4_NEG  (via drill 0.33)
  Top 0.152: v86.31,42.22 86.31,38.1 87.83,36.58 J2.2
  Bottom 0.152: D4.A 48.06,34.29 51.87,38.1 61.16,38.1 62.38,39.32 62.38,43.43 63.3,44.35 73.35,44.35 75.79,41.91 86,41.91 v86.31,42.22 | J1.3 114.66,11.43 114.66,10.52 115.72,9.45 115.72,8.38 114.96,7.62 108.71,7.62 105.05,11.28 105.05,18.44 103.68,19.81 103.68,23.77 100.63,26.82 97.74,26.82 87.99,36.58 J2.2
SCK  (via drill 0.33)
  Top 0.152: v102.92,40.69 102.92,38.71 103.53,38.1 | 103.53,38.1 107.34,34.29 JP2.10 | v87.07,24.54 96.67,34.14 99.57,34.14 103.53,38.1
  Bottom 0.152: v102.92,40.69 102.92,46.02 99.26,49.68 48.06,49.68 45.47,47.09 44.55,47.09 JP1.6 | AMIS-30543.7 77.77,15.24 v87.07,24.54
SCL  (via drill 0.33)
  Top 0.152: 98.81,43.89 98.96,43.89 U$4.P$4 98.81,43.89 | 98.81,43.89 92.71,43.89 U$2.P$4 | 98.81,43.89 v98.81,41.3 | R1.1 25.2,43.13 25.2,40.69 38.15,27.74 42.42,27.74 43.33,26.82 43.33,26.21 46.69,22.86 48.21,22.86 49.43,21.64 RTC-DS3231.6 | JP3.11 66.34,26.67 63.6,23.93 v57.51,23.93 | v80.97,30.63 86.61,30.63 90.88,34.9 92.71,34.9 U$1.P$4
  Bottom 0.152: 98.2,34.9 98.96,34.9 U$3.P$4 | 98.2,34.9 92.71,34.9 U$1.P$4 | 98.2,34.9 98.2,40.69 v98.81,41.3 | v57.51,23.93 56.74,23.93 56.13,23.32 51.26,23.32 RTC-DS3231.6 | v80.97,30.63 80.52,30.63 78.99,29.11 69.85,29.11 67.41,26.67 JP3.11
SDA  (via drill 0.33)
  Top 0.152: U$2.P$3 92.71,45.11 98.96,45.11 U$4.P$3 99.11,44.96 100.18,43.89 100.18,37.34 99.11,36.27 U$3.P$3 98.96,36.27 93.47,36.27 | 93.47,36.27 92.71,36.27 U$1.P$3 | v85.55,26.67 93.47,34.59 93.47,36.27 | v55.98,24.54 58.57,21.95 65.13,21.95 JP3.12
  Bottom 0.152: 41.96,23.93 43.03,22.86 45.77,22.86 46.99,21.64 RTC-DS3231.5 | 41.96,23.93 32.97,32.92 28.55,32.92 R2.1 | v85.55,26.67 JP3.12 | 41.96,23.93 42.57,24.54 v55.98,24.54
SHDN
  Bottom 0.152: STEPDOWN-D24V5F3.4 10.57,26.67 15.14,22.1 15.14,21.18 19.71,16.61 54.92,16.61 61.32,10.21 62.23,10.21 J5.5
SLA
  Top 0.152: AMIS-30543.12 77.47,3.35 73.66,7.16 73.66,10.67 66.5,17.83 63.45,17.83 J4.2
SQW/INT/D6  (via drill 0.33)
  Top 0.152: v56.9,24.54 59.18,24.54 61.32,26.67 JP3.9 63.3,25.6 v63.6,25.6 | v42.88,23.93 41.66,23.93 39.37,21.64 RTC-DS3231.2 39.37,21.49 45.47,15.39 v45.47,4.57 | v84.02,25.76 88.14,21.64 100.79,21.64 103.23,24.08 107.34,24.08 JP2.6
  Bottom 0.152: v56.9,24.54 56.29,23.93 v42.88,23.93 | v84.02,25.76 79.45,25.76 77.93,24.23 68.17,24.23 65.89,26.52 65.89,27.13 65.28,27.74 64.21,27.74 63.6,27.13 v63.6,25.6 | v45.47,4.57 J6.4
SWITCH-VOUT
  Top 0.152: STEPDOWN-D24V5F3.3 12.7,22.86 BIG-PUSH-B.8 14.07,21.64 16.51,21.64 BIG-PUSH-B.7
  Bottom 0.152: J5.3 67.26,10.21 66.5,10.21 59.79,16.92 21.08,16.92 16.51,21.49 BIG-PUSH-B.7
VBAT
  Top 0.152: JP3.1 41.96,26.67 41.96,25.76 45.77,21.95 45.77,21.03 56.59,10.21 59.64,10.21 J5.6
VBUS
  Top 0.152: JP3.3 47.9,26.67 51.11,23.47 54.92,23.47 58.27,20.12 58.27,18.75 65.58,11.43 71.07,11.43 72.29,10.21 J5.1
VDD/5V
  Top 0.152: 114.66,19.05 114.66,19.96 115.72,21.03 115.72,23.01 114.66,24.08 J1.8 115.72,25.3 115.72,27.28 114.66,28.35 114.66,29.11 J1.10 | 114.66,19.05 114.66,18.14 115.72,17.07 115.72,15.09 114.66,14.02 J1.4 | 114.66,19.05 J1.6 | D1.C D2.C D3.C D4.C | JP2.9 107.34,31.7 96.06,31.7 88.29,23.93 86.77,23.93 80.06,30.63 80.06,33.22 J8.1
  Bottom 0.152: JP2.9 107.34,31.7 107.34,30.63 106.27,29.57 106.27,18.59 107.19,17.68 107.8,17.68 108.56,16.92 108.56,13.56 107.49,12.5 106.88,12.5 106.27,11.89 106.27,10.97 106.88,10.36 111,10.36 114.5,13.87 J1.4 | 59.49,20.12 59.49,22.4 63.3,26.21 63.3,27.28 66.65,30.63 75.95,30.63 78.54,33.22 79.91,33.22 J8.1 | 59.49,20.12 59.49,19.36 J4.1 59.49,20.12 | 59.49,20.12 31.45,20.12 30.53,21.03 30.53,21.95 27.33,25.15 27.33,33.53 33.43,39.62 33.43,41.91 D1.C
VM  (via drill 0.33)
  Top 0.152: v88.29,47.7 86.61,47.7 84.48,49.84 55.83,49.84 53.54,47.55 53.54,45.72 56.29,42.98 R5.2
  Bottom 0.152: v88.29,47.7 91.49,44.5 91.49,43.89 92.41,42.98 99.72,42.98 104.44,38.25 107.64,38.25 108.56,37.34 108.56,21.18 107.49,20.12 107.49,19.05 JP2.4
VMOT
  Top 0.152: AMIS-1.3 100.33,25.45 104.14,25.45 106.73,28.04 107.8,28.04 111.76,32 111.76,41.6 114.5,44.35 J1.16

### Text on the board
tPlace: A0 | A1 | S1N | S2N | - | - | VMOT | GND | GND | + | + | GND | D12 | MI | TXP | TINGLY-TENTACLE | ver 0.1 | S4N | MO | TXN | 3VSTEP | D11 | S3N | GND | GND | SCK | TYN | 5V | D24V5F3 | 5V | TYP | 3V3 | 5V | FEATHER | GND | S1N | EXPRESS M0 | VMOT | INT | 5V | 5V | A5 | S2N | SLA | POR | ERR | CLR | DIR | 5V | 5V | VM | S3N | MOTOR | 5V | SWITCH | D1 | RTC | VBAT | SHDN | BAT | SOUT | CTRL | VBUS | D0 | S4N | 2812 | DS3231 | A2 | A3 | B | GND | OFF | ON | INT | A | A3 | 3V3 | GND | | | SLA